# EAGLE design core_stm32 (EAGLE 6.4)
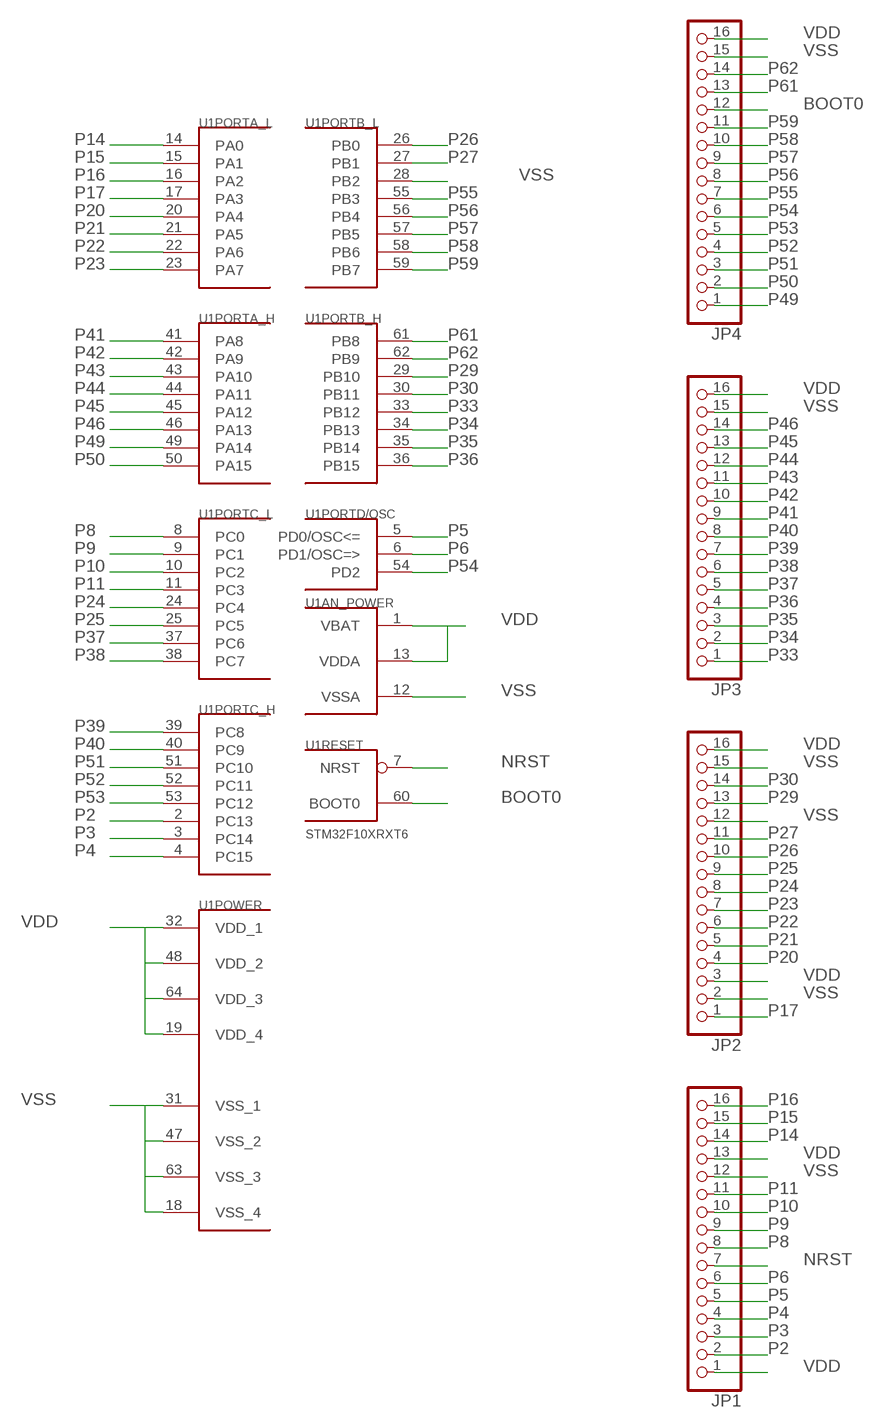
[diagram p0: schematic, sheet 1]

## Parts
JP1  PINHD-1X16  [1X16]
JP2  PINHD-1X16  [1X16]
JP3  PINHD-1X16  [1X16]
JP4  PINHD-1X16  [1X16]
U1  STM32F10XRXT6  [TQFP64]

## Nets
BOOT0: JP4.12 U1.60(RESET:BOOT0)
NRST: JP1.7 U1.7(RESET:NRST)
P2: JP1.2 U1.2(PORTC_H:PC13)
P3: JP1.3 U1.3(PORTC_H:PC14)
P4: JP1.4 U1.4(PORTC_H:PC15)
P5: JP1.5 U1.5(PORTD/OSC:PD0/OSC<=)
P6: JP1.6 U1.6(PORTD/OSC:PD1/OSC=>)
P8: JP1.8 U1.8(PORTC_L:PC0)
P9: JP1.9 U1.9(PORTC_L:PC1)
P10: JP1.10 U1.10(PORTC_L:PC2)
P11: JP1.11 U1.11(PORTC_L:PC3)
P14: JP1.14 U1.14(PORTA_L:PA0)
P15: JP1.15 U1.15(PORTA_L:PA1)
P16: JP1.16 U1.16(PORTA_L:PA2)
P17: JP2.1 U1.17(PORTA_L:PA3)
P20: JP2.4 U1.20(PORTA_L:PA4)
P21: JP2.5 U1.21(PORTA_L:PA5)
P22: JP2.6 U1.22(PORTA_L:PA6)
P23: JP2.7 U1.23(PORTA_L:PA7)
P24: JP2.8 U1.24(PORTC_L:PC4)
P25: JP2.9 U1.25(PORTC_L:PC5)
P26: JP2.10 U1.26(PORTB_L:PB0)
P27: JP2.11 U1.27(PORTB_L:PB1)
P29: JP2.13 U1.29(PORTB_H:PB10)
P30: JP2.14 U1.30(PORTB_H:PB11)
P33: JP3.1 U1.33(PORTB_H:PB12)
P34: JP3.2 U1.34(PORTB_H:PB13)
P35: JP3.3 U1.35(PORTB_H:PB14)
P36: JP3.4 U1.36(PORTB_H:PB15)
P37: JP3.5 U1.37(PORTC_L:PC6)
P38: JP3.6 U1.38(PORTC_L:PC7)
P39: JP3.7 U1.39(PORTC_H:PC8)
P40: JP3.8 U1.40(PORTC_H:PC9)
P41: JP3.9 U1.41(PORTA_H:PA8)
P42: JP3.10 U1.42(PORTA_H:PA9)
P43: JP3.11 U1.43(PORTA_H:PA10)
P44: JP3.12 U1.44(PORTA_H:PA11)
P45: JP3.13 U1.45(PORTA_H:PA12)
P46: JP3.14 U1.46(PORTA_H:PA13)
P49: JP4.1 U1.49(PORTA_H:PA14)
P50: JP4.2 U1.50(PORTA_H:PA15)
P51: JP4.3 U1.51(PORTC_H:PC10)
P52: JP4.4 U1.52(PORTC_H:PC11)
P53: JP4.5 U1.53(PORTC_H:PC12)
P54: JP4.6 U1.54(PORTD/OSC:PD2)
P55: JP4.7 U1.55(PORTB_L:PB3)
P56: JP4.8 U1.56(PORTB_L:PB4)
P57: JP4.9 U1.57(PORTB_L:PB5)
P58: JP4.10 U1.58(PORTB_L:PB6)
P59: JP4.11 U1.59(PORTB_L:PB7)
P61: JP4.13 U1.61(PORTB_H:PB8)
P62: JP4.14 U1.62(PORTB_H:PB9)
VDD: JP1.1 JP1.13 JP2.3 JP2.16 JP3.16 JP4.16 U1.1(AN_POWER:VBAT) U1.13(AN_POWER:VDDA) U1.19(POWER:VDD_4) U1.32(POWER:VDD_1) U1.48(POWER:VDD_2) U1.64(POWER:VDD_3)
VSS: JP1.12 JP2.2 JP2.12 JP2.15 JP3.15 JP4.15 U1.12(AN_POWER:VSSA) U1.18(POWER:VSS_4) U1.28(PORTB_L:PB2) U1.31(POWER:VSS_1) U1.47(POWER:VSS_2) U1.63(POWER:VSS_3)

## Library data of the parts
JP1-JP4 = pinhead:PINHD-1X16: PIN HEADER
U1 = stm32:STM32F10XRXT6: STM32F101/103 64pin LQFP

## Board
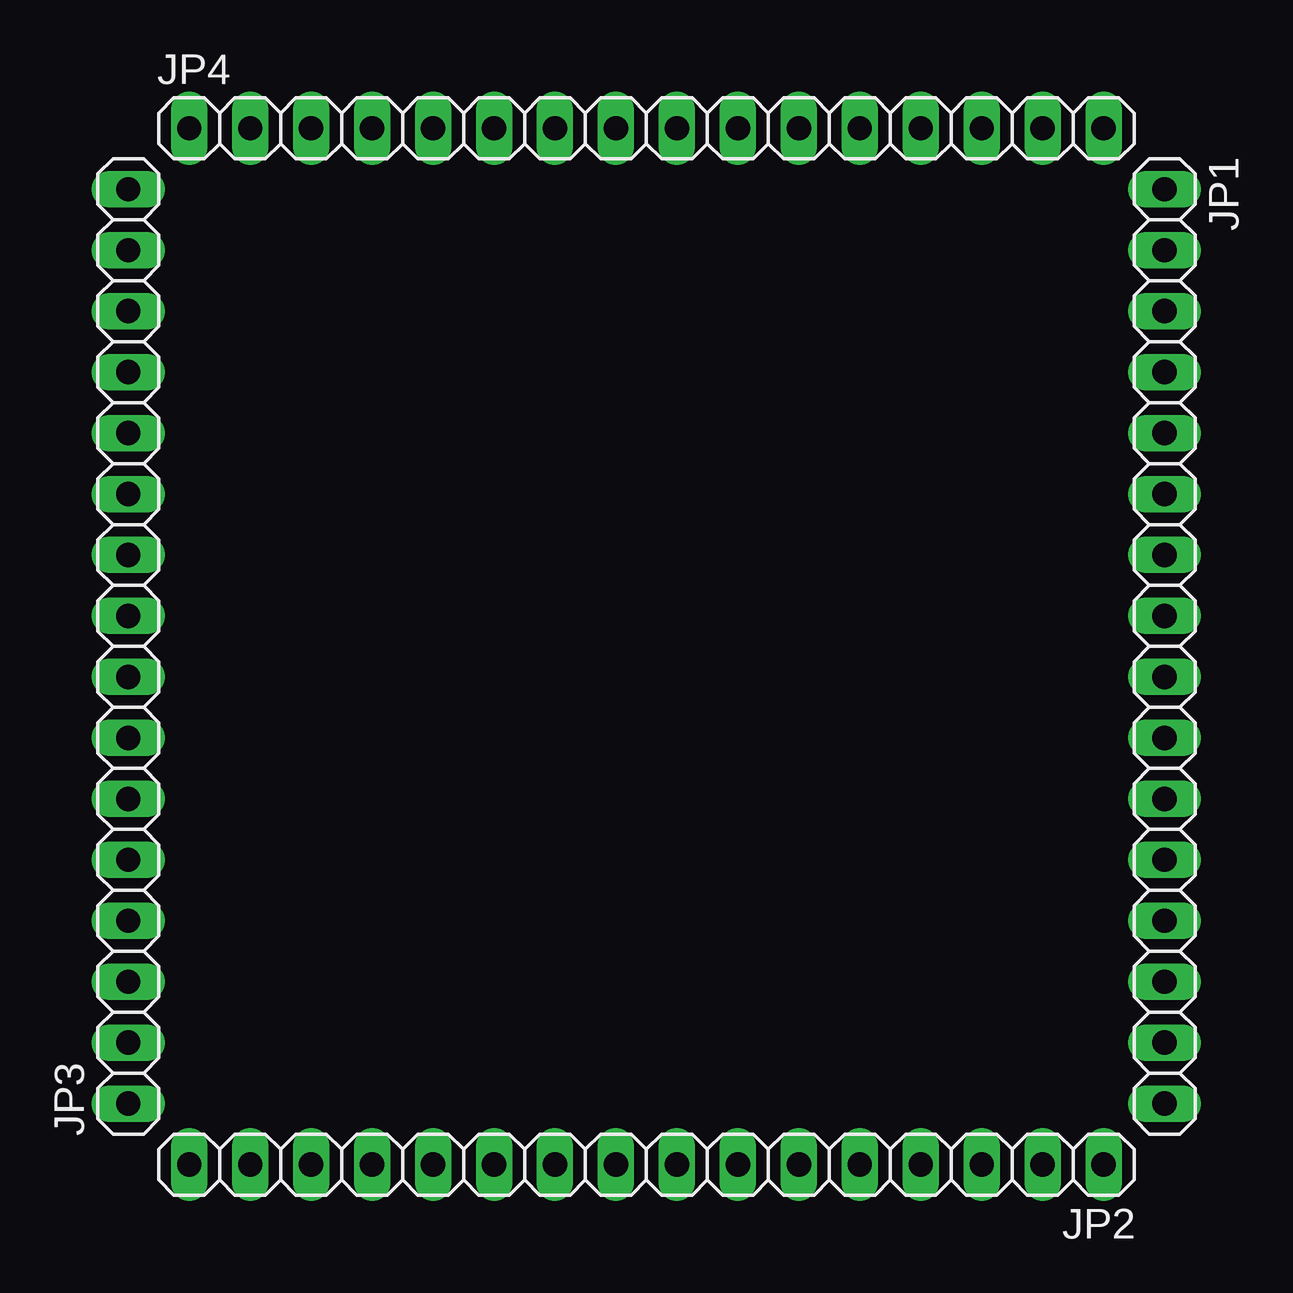
[diagram p1: board, top side]
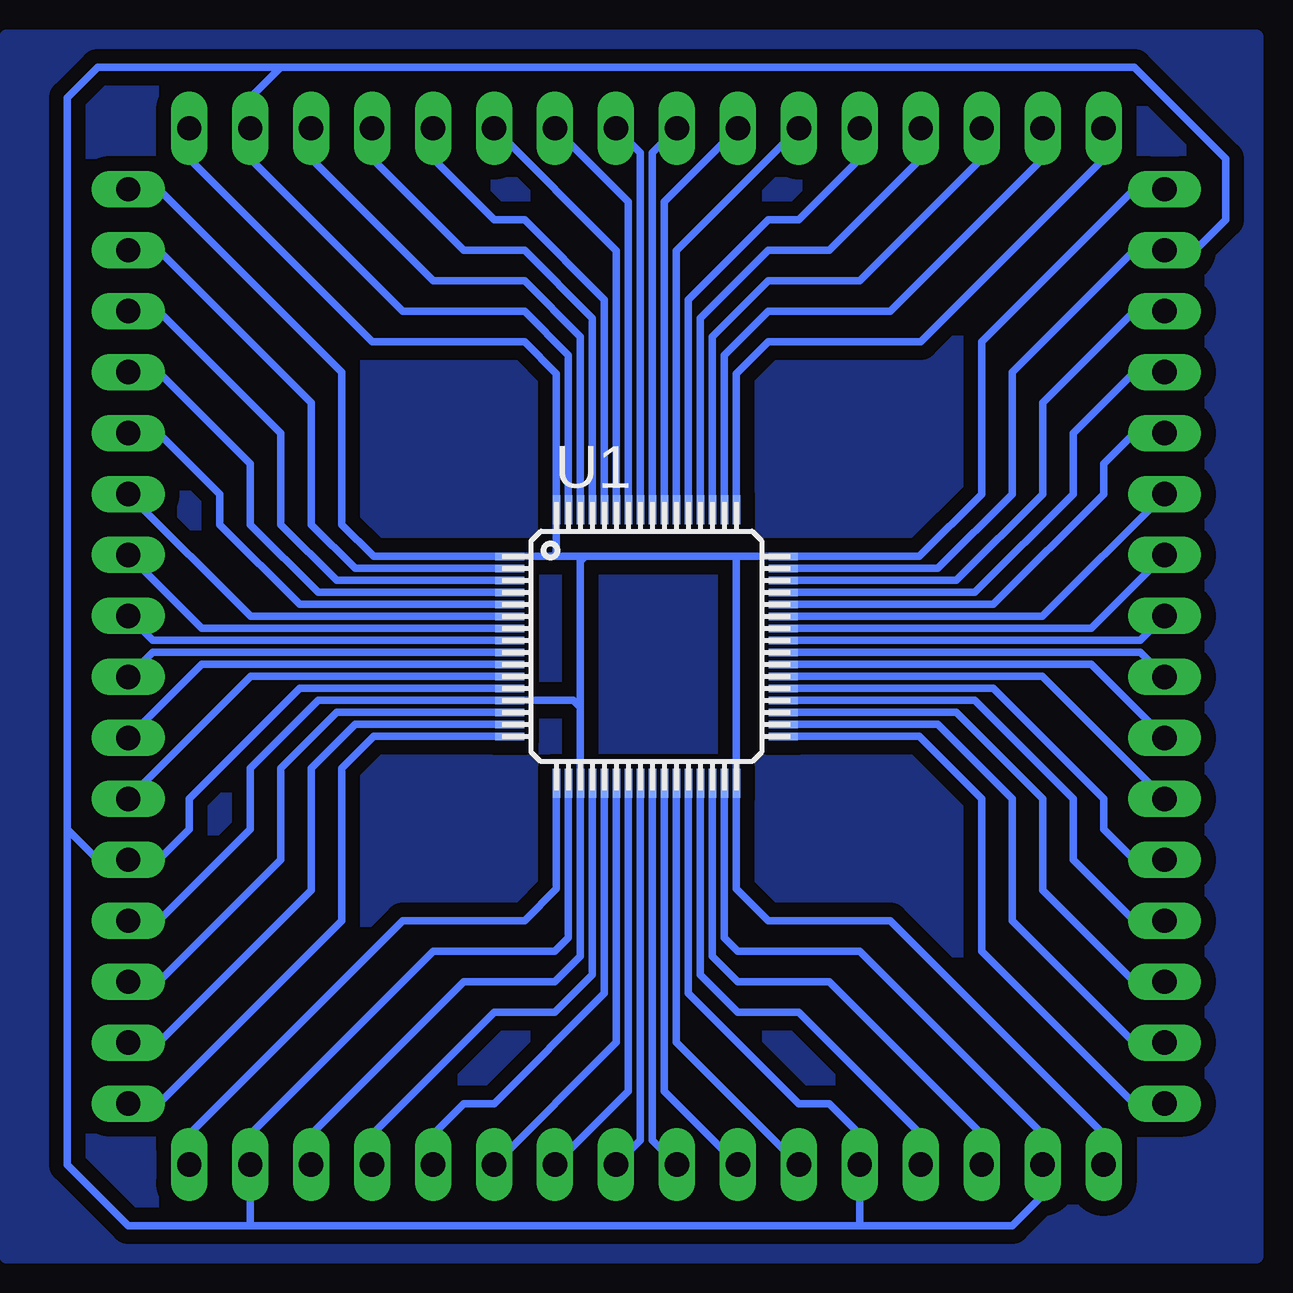
[diagram p2: board, bottom side, seen from below]

No outline drawn. Coordinates in mm, seen from the top.
Copper layers (1*16): Top 0.035mm / dielectric 1.5mm / Bottom 0.035mm
Design rules "default": minimum track width 10mil, minimum drill 24mil, track to track 8mil, track to pad 8mil, pad to pad 8mil, via to via 8mil, smd to smd 8mil, copper to edge 40mil, drill to drill 8mil, minimum pad ring 10mil, minimum via ring 8mil, stop-mask expansion 4mil, vias tented up to drill 0mil, thermal gap 10mil

### Footprints (pad centres in the part's own frame; a part is rotated, then mirrored left to right if it is on the bottom)
1X16 = drill 1.016 long: 1 -19.05,0; 2 -16.51,0; 3 -13.97,0; 4 -11.43,0; 5 -8.89,0; 6 -6.35,0; 7 -3.81,0; 8 -1.27,0; 9 1.27,0; 10 3.81,0; 11 6.35,0; 12 8.89,0; 13 11.43,0; 14 13.97,0; 15 16.51,0; 16 19.05,0
TQFP64 = smd 1.2 x 0.3: 1 -5.7,3.75; 2 -5.7,3.25; 3 -5.7,2.75; 4 -5.7,2.25; 5 -5.7,1.75; 6 -5.7,1.25; 7 -5.7,0.75; 8 -5.7,0.25; 9 -5.7,-0.25; 10 -5.7,-0.75; 11 -5.7,-1.25; 12 -5.7,-1.75; 13 -5.7,-2.25; 14 -5.7,-2.75; 15 -5.7,-3.25; 16 -5.7,-3.75; 33 5.7,-3.75; 34 5.7,-3.25; 35 5.7,-2.75; 36 5.7,-2.25; 37 5.7,-1.75; 38 5.7,-1.25; 39 5.7,-0.75; 40 5.7,-0.25; 41 5.7,0.25; 42 5.7,0.75; 43 5.7,1.25; 44 5.7,1.75; 45 5.7,2.25; 46 5.7,2.75; 47 5.7,3.25; 48 5.7,3.75 | smd 0.3 x 1.2: 17 -3.75,-5.7; 18 -3.25,-5.7; 19 -2.75,-5.7; 20 -2.25,-5.7; 21 -1.75,-5.7; 22 -1.25,-5.7; 23 -0.75,-5.7; 24 -0.25,-5.7; 25 0.25,-5.7; 26 0.75,-5.7; 27 1.25,-5.7; 28 1.75,-5.7; 29 2.25,-5.7; 30 2.75,-5.7; 31 3.25,-5.7; 32 3.75,-5.7; 49 3.75,5.7; 50 3.25,5.7; 51 2.75,5.7; 52 2.25,5.7; 53 1.75,5.7; 54 1.25,5.7; 55 0.75,5.7; 56 0.25,5.7; 57 -0.25,5.7; 58 -0.75,5.7; 59 -1.25,5.7; 60 -1.75,5.7; 61 -2.25,5.7; 62 -2.75,5.7; 63 -3.25,5.7; 64 -3.75,5.7

### Placement (x,y rotation side)
JP1  72.39,39.37 270 top
JP2  50.8,17.78 180 top
JP3  29.21,39.37 90 top
JP4  50.8,60.96 0 top
U1  50.8,39.37 0 bottom

### Tracks (layer width: path | path; a pad name or v marks a point on that pad's centre or on a via)
BOOT0
  Bottom 0.305: U1.60 52.55,53.82 55.88,57.15 57.15,57.15 59.69,59.69 JP4.12
N$1
  pour Bottom (isolate 0.61): 25.4,64.77 77.47,64.77 77.47,13.97 25.4,13.97
NRST
  Bottom 0.305: U1.7 69.33,40.12 JP1.7
P2
  Bottom 0.305: U1.2 62.94,42.62 64.77,44.45 64.77,49.53 71.12,55.88 JP1.2
P3
  Bottom 0.305: U1.3 63.71,42.12 66.04,44.45 66.04,48.26 71.12,53.34 JP1.3
P4
  Bottom 0.305: U1.4 64.48,41.62 67.31,44.45 67.31,46.99 71.12,50.8 JP1.4
P5
  Bottom 0.305: U1.5 65.25,41.12 68.58,44.45 68.58,45.72 71.12,48.26 JP1.5
P6
  Bottom 0.305: U1.6 67.29,40.62 JP1.6
P8
  Bottom 0.305: U1.8 71.37,39.62 JP1.8
P9
  Bottom 0.305: U1.9 71.37,39.12 JP1.9
P10
  Bottom 0.305: U1.10 69.33,38.62 JP1.10
P11
  Bottom 0.305: U1.11 67.29,38.12 JP1.11
P14
  Bottom 0.305: U1.14 63.71,36.62 66.04,34.29 66.04,30.48 71.12,25.4 JP1.14
P15
  Bottom 0.305: U1.15 62.94,36.12 64.77,34.29 64.77,29.21 71.12,22.86 JP1.15
P16
  Bottom 0.305: U1.16 62.17,35.62 63.5,34.29 63.5,27.94 71.12,20.32 JP1.16
P17
  Bottom 0.305: U1.17 54.55,29.27 55.88,27.94 60.96,27.94 69.85,19.05 JP2.1
P20
  Bottom 0.305: U1.20 53.05,25.69 54.61,24.13 57.15,24.13 62.23,19.05 JP2.4
P21
  Bottom 0.305: U1.21 52.55,24.92 57.15,20.32 58.42,20.32 59.69,19.05 JP2.5
P22
  Bottom 0.305: U1.22 52.05,22.88 JP2.6
P23
  Bottom 0.305: U1.23 51.55,20.84 JP2.7
P24
  Bottom 0.305: U1.24 51.05,18.8 JP2.8
P25
  Bottom 0.305: U1.25 50.55,18.8 JP2.9
P26
  Bottom 0.305: U1.26 50.05,20.84 JP2.10
P27
  Bottom 0.305: U1.27 49.55,22.88 JP2.11
P29
  Bottom 0.305: U1.29 48.55,25.69 46.99,24.13 44.45,24.13 39.37,19.05 JP2.13
P30
  Bottom 0.305: U1.30 48.05,26.46 46.99,25.4 43.18,25.4 36.83,19.05 JP2.14
P33
  Bottom 0.305: U1.33 39.43,35.62 36.83,33.02 36.83,26.67 30.48,20.32 JP3.1
P34
  Bottom 0.305: U1.34 38.66,36.12 35.56,33.02 35.56,27.94 30.48,22.86 JP3.2
P35
  Bottom 0.305: U1.35 37.89,36.62 34.29,33.02 34.29,29.21 30.48,25.4 JP3.3
P36
  Bottom 0.305: U1.36 37.12,37.12 33.02,33.02 33.02,30.48 30.48,27.94 JP3.4
P37
  Bottom 0.305: U1.37 36.35,37.62 31.75,33.02 31.75,31.75 30.48,30.48 JP3.5
P38
  Bottom 0.305: U1.38 34.31,38.12 JP3.6
P39
  Bottom 0.305: U1.39 32.27,38.62 JP3.7
P40
  Bottom 0.305: U1.40 30.23,39.12 JP3.8
P41
  Bottom 0.305: U1.41 30.23,39.62 JP3.9
P42
  Bottom 0.305: U1.42 32.27,40.12 JP3.10
P43
  Bottom 0.305: U1.43 34.31,40.62 JP3.11
P44
  Bottom 0.305: U1.44 36.35,41.12 31.75,45.72 31.75,46.99 30.48,48.26 JP3.12
P45
  Bottom 0.305: U1.45 37.12,41.62 33.02,45.72 33.02,48.26 30.48,50.8 JP3.13
P46
  Bottom 0.305: U1.46 37.89,42.12 34.29,45.72 34.29,49.53 30.48,53.34 JP3.14
P49
  Bottom 0.305: U1.49 47.05,50.74 45.72,52.07 39.37,52.07 31.75,59.69 JP4.1
P50
  Bottom 0.305: U1.50 47.55,51.51 45.72,53.34 40.64,53.34 34.29,59.69 JP4.2
P51
  Bottom 0.305: U1.51 48.05,52.28 45.72,54.61 41.91,54.61 36.83,59.69 JP4.3
P52
  Bottom 0.305: U1.52 48.55,53.05 45.72,55.88 43.18,55.88 39.37,59.69 JP4.4
P53
  Bottom 0.305: U1.53 49.05,53.82 45.72,57.15 44.45,57.15 41.91,59.69 JP4.5
P54
  Bottom 0.305: U1.54 49.55,55.86 JP4.6
P55
  Bottom 0.305: U1.55 50.05,57.9 JP4.7
P56
  Bottom 0.305: U1.56 50.55,59.94 JP4.8
P57
  Bottom 0.305: U1.57 51.05,59.94 JP4.9
P58
  Bottom 0.305: U1.58 51.55,57.9 JP4.10
P59
  Bottom 0.305: U1.59 52.05,55.86 JP4.11
P61
  Bottom 0.305: U1.61 53.05,53.05 55.88,55.88 58.42,55.88 62.23,59.69 JP4.13
P62
  Bottom 0.305: U1.62 53.55,52.28 55.88,54.61 59.69,54.61 64.77,59.69 JP4.14
VDD
  Bottom 0.305: JP1.13 71.12,27.94 67.31,31.75 67.31,34.29 64.48,37.12 U1.13 53.84,37.12 53.55,36.83 | U1.1 62.17,43.12 63.5,44.45 63.5,50.8 71.12,58.42 JP1.1 | JP2.3 64.77,19.05 58.42,25.4 54.61,25.4 53.55,26.46 U1.19 53.55,36.83 | JP2.16 31.75,19.05 40.64,27.94 45.72,27.94 47.05,29.27 U1.32 47.05,43.06 46.99,43.12 | JP4.16 69.85,59.69 62.23,52.07 55.88,52.07 54.55,50.74 U1.64 54.55,43.24 54.67,43.12 U1.1 | JP3.16 30.48,58.42 36.83,52.07 36.83,45.72 39.43,43.12 U1.48 46.99,43.12 | 46.99,43.12 53.34,43.12 | 53.34,43.12 U1.1 | 53.55,36.83 53.55,42.91 53.34,43.12
VSS
  Bottom 0.305: U1.12 65.25,37.62 69.85,33.02 69.85,31.75 71.12,30.48 JP1.12 73.66,30.48 74.93,31.75 | U1.28 49.05,24.92 44.45,20.32 43.18,20.32 41.91,19.05 JP2.12 41.91,15.24 | U1.18 54.05,27.23 54.61,26.67 59.69,26.67 67.31,19.05 JP2.2 67.31,15.24 | U1.31 47.55,27.23 46.99,26.67 41.91,26.67 34.29,19.05 JP2.15 34.29,16.51 35.56,15.24 41.91,15.24 | U1.63 54.05,51.51 55.88,53.34 60.96,53.34 67.31,59.69 JP4.15 67.31,62.23 66.04,63.5 | U1.47 38.66,42.62 35.56,45.72 35.56,50.8 30.48,55.88 JP3.15 27.94,55.88 26.67,57.15 26.67,59.69 30.48,63.5 66.04,63.5 | 74.93,31.75 74.93,62.23 73.66,63.5 66.04,63.5 | 41.91,15.24 67.31,15.24 | 67.31,15.24 72.39,15.24 74.93,17.78 74.93,31.75